# EAGLE schematic HHC (EAGLE 6.2)
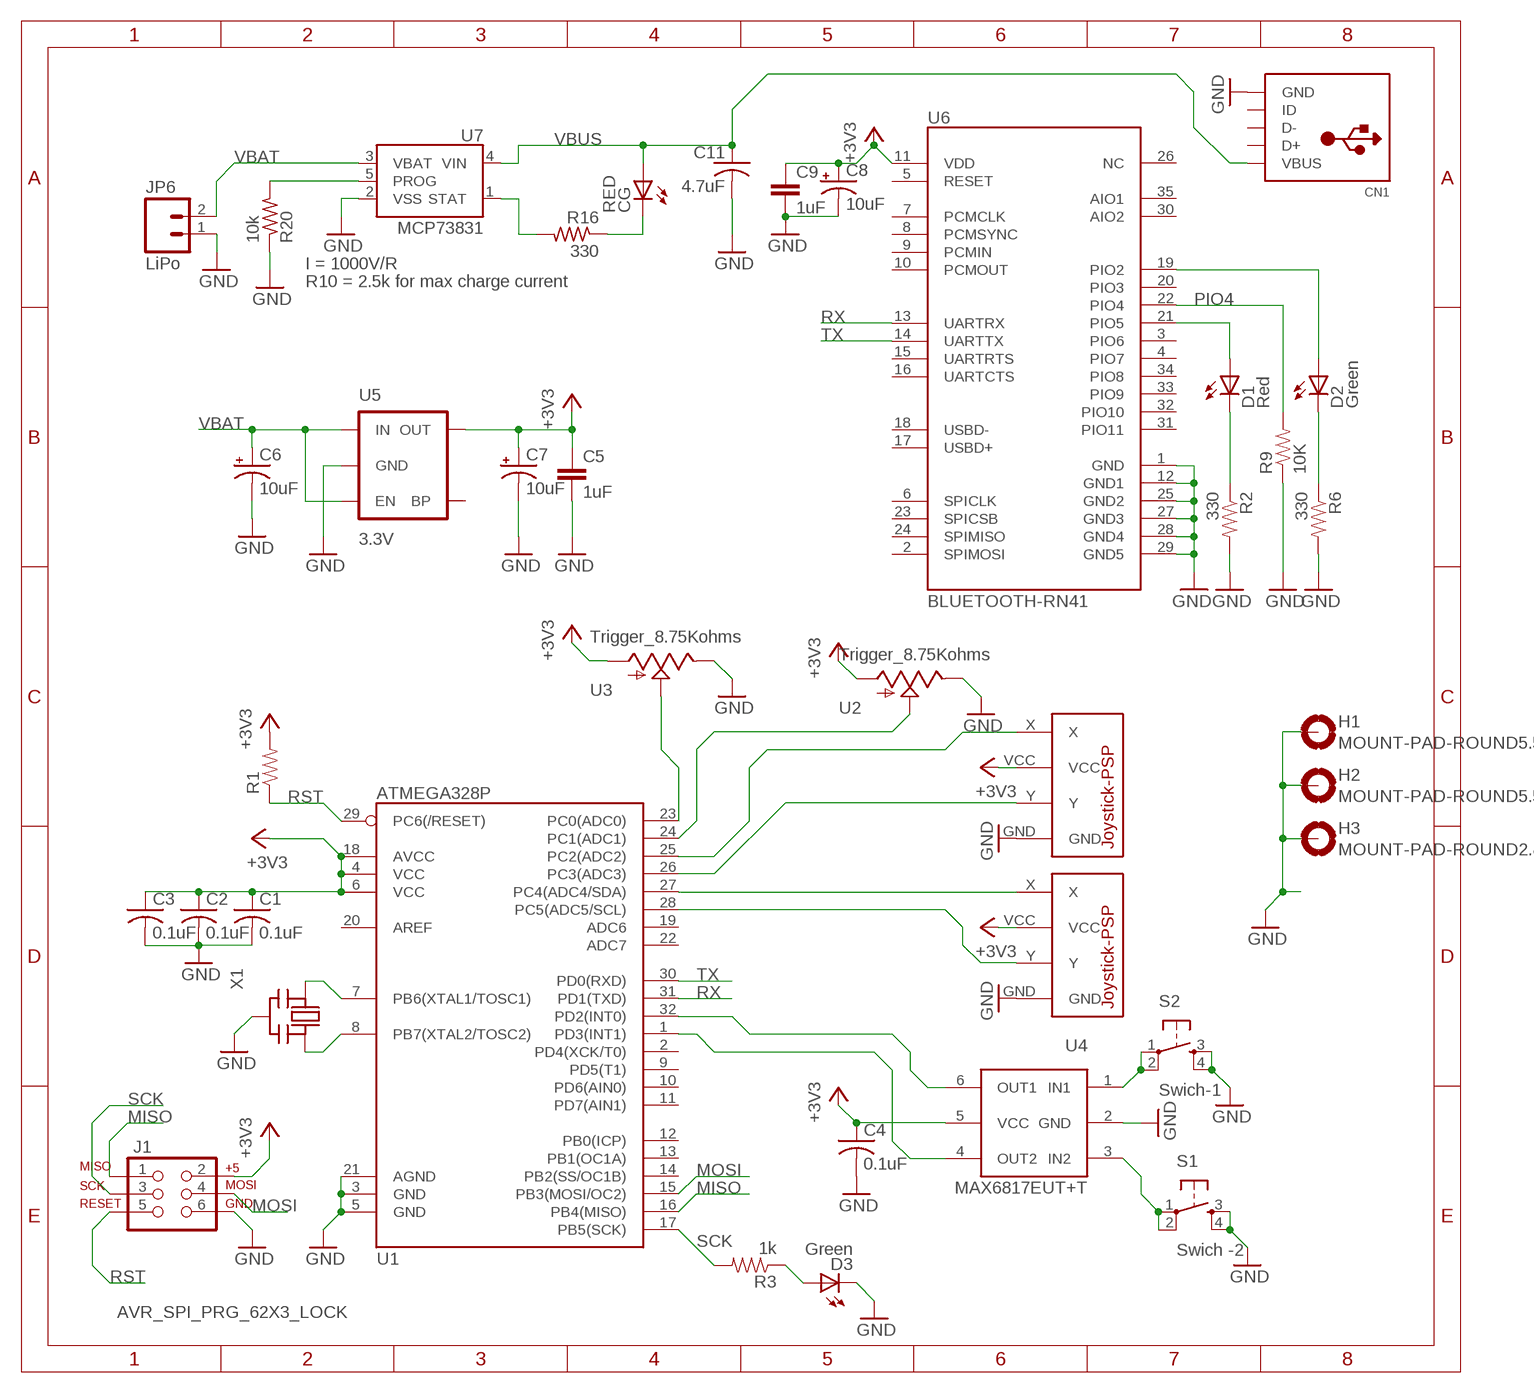
[diagram p0: schematic, sheet 1]

## Parts
C1  0.1uF  C-USC0805  [C0805]
C2  0.1uF  C-USC0805  [C0805]
C3  0.1uF  C-USC0805  [C0805]
C4  0.1uF  C-USC0805  [C0805]
C5  1uF  CAP0805  [0805]
C6  10uF  CAP_POL1206  [EIA3216]
C7  10uF  CAP_POL1206  [EIA3216]
C8  10uF  CAP_POL1206  [EIA3216]
C9  1uF  CAP0805  [0805]
C11  4.7uF  C-USC0805  [C0805]
CG  RED  LEDSML0805  [SML0805]
CN1  USBMINIB  [USB-MINIB]
D1  Red  LED0603  [LED-0603]
D2  Green  LED0603  [LED-0603]
D3  Green  LED0603  [LED-0603]
H1  MOUNT-PAD-ROUND5.5  [5,5-PAD]
H2  MOUNT-PAD-ROUND5.5  [5,5-PAD]
H3  MOUNT-PAD-ROUND2.8  [2,8-PAD]
J1  AVR_SPI_PRG_62X3_LOCK  [2X3_LOCK]
JP6  LiPo  M02-JST-2MM-SMT  [JST-2-SMD]
R1  RESISTOR0805-RES  [0805]
R2  330  RESISTOR0805-RES  [0805]
R3  1k  RESISTOR0805-RES  [0805]
R6  330  RESISTOR0805-RES  [0805]
R9  10K  RESISTOR0805-RES  [0805]
R16  330  R-US_R0805  [R0805]
R20  10k  R-US_R0805  [R0805]
S1  Swich -2  TAC_SWITCHPTH  [TACTILE-PTH]
S2  Swich-1  TAC_SWITCHPTH  [TACTILE-PTH]
U1  ATMEGA328P  ATMEGA328_SMT  [TQFP32-08]
U2  TRIGGEREDGE_MOUNTED  [TRIGGER_EDGEMOUNT]
U3  TRIGGEREDGE_MOUNTED  [TRIGGER_EDGEMOUNT]
U4  MAX6817EUT+T  [SOT23-6]
U5  3.3V  V_REG_LDOSMD  [SOT23-5]
U6  BLUETOOTH-RN41  BLUETOOTH-RN41"  [RN41]
U7  MCP73831  [SOT23-5]
U$1  JOYSTICK-PSP1000  [JOYSTICK-PSP1000]
U$2  JOYSTICK-PSP1000  [JOYSTICK-PSP1000]
X1  CERMOSCILL-AWCSR  [AWCSR]

## Nets
+3V3: C1.1 C2.1 C3.1 C4.1 C5.1 C7.A(+) C8.A(+) C9.1 J1.2 R1.2 U1.4(VCC) U1.6(VCC) U1.18(AVCC) U2.P$1 U3.P$1 U4.5(VCC) U5.5(OUT) U6.11(VDD) U$1.VCC U$2.VCC
D1: D1.C R2.1
D2: D2.C R6.1
GND: C1.2 C2.2 C3.2 C4.2 C5.2 C6.C(-) C7.C(-) C8.C(-) C9.2 C11.2 CN1.GND D3.C H1.B5,5(MOUNT) H2.B5,5(MOUNT) H3.B2,8(MOUNT) J1.6 JP6.1 R2.2 R6.2 R9.1 R20.1 S1.3 S1.4 S2.3 S2.4 U1.3(GND) U1.5(GND) U1.21(AGND) U2.P$3 U3.P$3 U4.2(GND) U5.2(GND) U6.1(GND) U6.12(GND1) U6.25(GND2) U6.27(GND3) U6.28(GND4) U6.29(GND5) U7.2(VSS) U$1.GND U$2.GND X1.2(GND)
MISO: J1.1 U1.16(PB4(MISO))
MOSI: J1.4 U1.15(PB3(MOSI/OC2))
N$1: U1.23(PC0(ADC0)) U3.P$2
N$2: U1.24(PC1(ADC1)) U2.P$2
N$3: S2.1 S2.2 U4.1(IN1)
N$4: U1.25(PC2(ADC2)) U$2.X
N$6: U1.26(PC3(ADC3)) U$2.Y
N$7: U1.27(PC4(ADC4/SDA)) U$1.X
N$8: U1.28(PC5(ADC5/SCL)) U$1.Y
N$9: D1.A U6.21(PIO5)
N$10: D2.A U6.19(PIO2)
N$11: U1.7(PB6(XTAL1/TOSC1)) X1.1(IN)
N$12: U1.32(PD2(INT0)) U4.6(OUT1)
N$13: U1.1(PD3(INT1)) U4.4(OUT2)
N$14: U1.8(PB7(XTAL2/TOSC2)) X1.3(OUT)
N$15: S1.1 S1.2 U4.3(IN2)
N$17: D3.A R3.1
N$44: CG.C R16.1
PIO4: R9.2 U6.22(PIO4)
PROG: R20.2 U7.5(PROG)
RST: J1.5 R1.1 U1.29(PC6(/RESET))
RX: U1.31(PD1(TXD)) U6.13(UARTRX)
SCK: J1.3 R3.2 U1.17(PB5(SCK))
STAT: R16.2 U7.1(STAT)
TX: U1.30(PD0(RXD)) U6.14(UARTTX)
VBAT: C6.A(+) JP6.2 U5.1(IN) U5.3(EN) U7.3(VBAT)
VBUS: C11.1 CG.A CN1.VBUS U7.4(VIN)
Unconnected: CN1.D+ CN1.D- CN1.ID U1.2(PD4(XCK/T0)) U1.9(PD5(T1)) U1.10(PD6(AIN0)) U1.11(PD7(AIN1)) U1.12(PB0(ICP)) U1.13(PB1(OC1A)) U1.14(PB2(SS/OC1B)) U1.19(ADC6) U1.20(AREF) U1.22(ADC7) U5.4(BP) U6.2(SPIMOSI) U6.3(PIO6) U6.4(PIO7) U6.5(RESET) U6.6(SPICLK) U6.7(PCMCLK) U6.8(PCMSYNC) U6.9(PCMIN) U6.10(PCMOUT) U6.15(UARTRTS) U6.16(UARTCTS) U6.17(USBD+) U6.18(USBD-) U6.20(PIO3) U6.23(SPICSB) U6.24(SPIMISO) U6.26(NC) U6.30(AIO2) U6.31(PIO11) U6.32(PIO10) U6.33(PIO9) U6.34(PIO8) U6.35(AIO1)

## Notes on the sheet
- I = 1000V/R
- R10 = 2.5k for max charge current

## Library data of the parts
C1-C4 = adafruit:C-US: CAPACITOR, American symbol
C5 C9 = SparkFun:CAP: Capacitor Standard 0603 ceramic capacitor, and 0.1" leaded capacitor.
C6-C8 = SparkFun:CAP_POL: Capacitor Polarized These are standard SMD and PTH capacitors. Normally 10uF, 47uF, and 100uF in electrolytic and tantalum varieties. Always verify the external diameter of the through hole cap, it varies with capacity, voltage, and manufacturer. The EIA devices should be standard.
C11 = resistor:C-US: CAPACITOR, American symbol
CG = led:LED: LED OSRAM: - CHIPLED LG R971, LG N971, LY N971, LG Q971, LY Q971, LO R971, LY R971 LH N974, LH R974 LS Q976, LO Q976, LY Q976 LO Q996 - Hyper CHIPLED LW Q18S LB Q993, LB Q99A, LB R99A - SideLED LS A670, LO A670, LY A670, LG A670, LP A670 LB A673, LV A673, LT A673, LW A673 LH A674 LY A675 LS A676, LA A676, LO A676, LY A676, LW A676 LS A679, LY A679, LG A679 - Hyper Micro SIDELED® LS Y876, LA Y876, LO Y876, LY Y876 LT Y87S - SmartLED LW L88C, LW L88S LB L89C, LB L89S, LG L890 LS L89K, LO L89K, LY L89K LS L896, LA L896, LO L896, LY L896 - TOPLED LS T670, LO T670, LY T670, LG T670, LP T670 LSG T670, LSP T670, LSY T670, LOP T670, LYG T670 LG T671, LOG T671, LSG T671 LB T673, LV T673, LT T673, LW T673 LH T674 LS T676, LA T676, LO T676, LY T676, LB T676, LH T676, LSB T676, LW T676 LB T67C, LV T67C, LT T67C, LS T67K, LO T67K, LY T67K, LW E67C LS E67B, LA E67B, LO E67B, LY E67B, LB E67C, LV E67C, LT E67C LW T67C LS T679, LY T679, LG T679 LS T770, LO T770, LY T770, LG T770, LP T770 LB T773, LV T773, LT T773, LW T773 LH T774 LS E675, LA E675, LY E675, LS T675 LS T776, LA T776, LO T776, LY T776, LB T776 LHGB T686 LT T68C, LB T68C - Hyper Mini TOPLED® LB M676 - Mini TOPLED Santana® LG M470 LS M47K, LO M47K, LY M47K Source: http://www.osram.convergy.de LUXEON: - LUMILED® LXK2-PW12-R00, LXK2-PW12-S00, LXK2-PW14-U00, LXK2-PW14-V00 LXK2-PM12-R00, LXK2-PM12-S00, LXK2-PM14-U00 LXK2-PE12-Q00, LXK2-PE12-R00, LXK2-PE12-S00, LXK2-PE14-T00, LXK2-PE14-U00 LXK2-PB12-K00, LXK2-PB12-L00, LXK2-PB12-M00, LXK2-PB14-N00, LXK2-PB14-P00, LXK2-PB14-Q00 LXK2-PR12-L00, LXK2-PR12-M00, LXK2-PR14-Q00, LXK2-PR14-R00 LXK2-PD12-Q00, LXK2-PD12-R00, LXK2-PD12-S00 LXK2-PH12-R00, LXK2-PH12-S00 LXK2-PL12-P00, LXK2-PL12-Q00, LXK2-PL12-R00 Source: www.luxeon.com KINGBRIGHT: KA-3528ASYC Source: www.kingbright.com
CN1 = adafruit:USB: USB Connectors USBMINIB - Surface Mount Female Mini-B USB Connector 4UConnector: 06564 By microbuilder.eu Thru-hole RA Female Mini-B USB Connector 4UConnector: 18732 By ladyada.net
D1-D3 = SparkFun:LED: LEDs Standard schematic elements and footprints for 5mm, 3mm, 1206, and 0603 sized LEDs. 5mm - Spark Fun Electronics SKU : COM-00529 (and others)
H1-H3 = holes:MOUNT-PAD-ROUND: MOUNTING PAD, round
J1 = SparkFun:AVR_SPI_PRG_6: AVR ISP 6 Pin This is the reduced ISP connector for AVR programming. Common on Arduino. This footprint will take up less PCB space and can be used with a 10-pin to 6-pin adapter such as SKU: BOB-08508
JP6 = SparkFun:M02: Header 2 Standard 2-pin 0.1" header. Use with straight break away headers (SKU : PRT-00116), right angle break away headers (PRT-00553), swiss pins (PRT-00743), machine pins (PRT-00117), and female headers (PRT-00115). Molex polarized connector foot print use with SKU : PRT-08233 with associated crimp pins and housings.
R1 R3 = SparkFun-Resistors:RESISTOR: Resistor Basic schematic elements and footprints for 0603, 1206, and PTH resistors.
R2 R6 R9 = SparkFun:RESISTOR: Resistor Basic schematic elements and footprints for 0603, 1206, and PTH resistors.
R16 R20 = resistor:R-US_: RESISTOR, American symbol
S1 S2 = SparkFun-Electromechanical:TAC_SWITCH: Momentary Switch Button commonly used for reset or general input. Spark Fun Electronics SKU : COM-00097 SMT- SWCH-08247
U1 = SparkFun-DigitalIC:ATMEGA328_SMT: 32-Pin Atmega328 part Commonly used on Arduino compatible boards Available in QFP and QFN packages TQFP is IC-09069 QFN is non-stock; PROD_ID: IC-09069
U2 U3 = Local Library:TRIGGER
U4 = NASA_LIB:MAX6817EUT+T
U5 = SparkFun:V_REG_LDO: Voltage Regulator LDO Standard 150mA LDO voltage regulator in SOT-23 layout. Micrel part MIC5205. BP (by-pass) pin is used to lower output noise with 470pF cap.
U6 = ScratchPad:BLUETOOTH-RN41
U7 = SparkFun:MCP73831: Microchip's MCP73831 Miniature single cell, fully integrated Li-Ion, Li-polymer charge management controller http://ww1.microchip.com/downloads/en/DeviceDoc/21984a.pdf
U$1 U$2 = SparkFun-Electromechanical:JOYSTICK-PSP1000: This is a footprint for the PSP-1000 Joystick. 4-pins: X, Y, Vcc and GND
X1 = adafruit:CERMOSCILL: Ceramic oscillator with built in capacitors such as ZTT-12MHz http://www.ladyada.net/library/eagle

## Net classes
0 Default: width 0.203 mm